# Altium schematic sheet Power Supply.SchDoc (part 5 of 5)
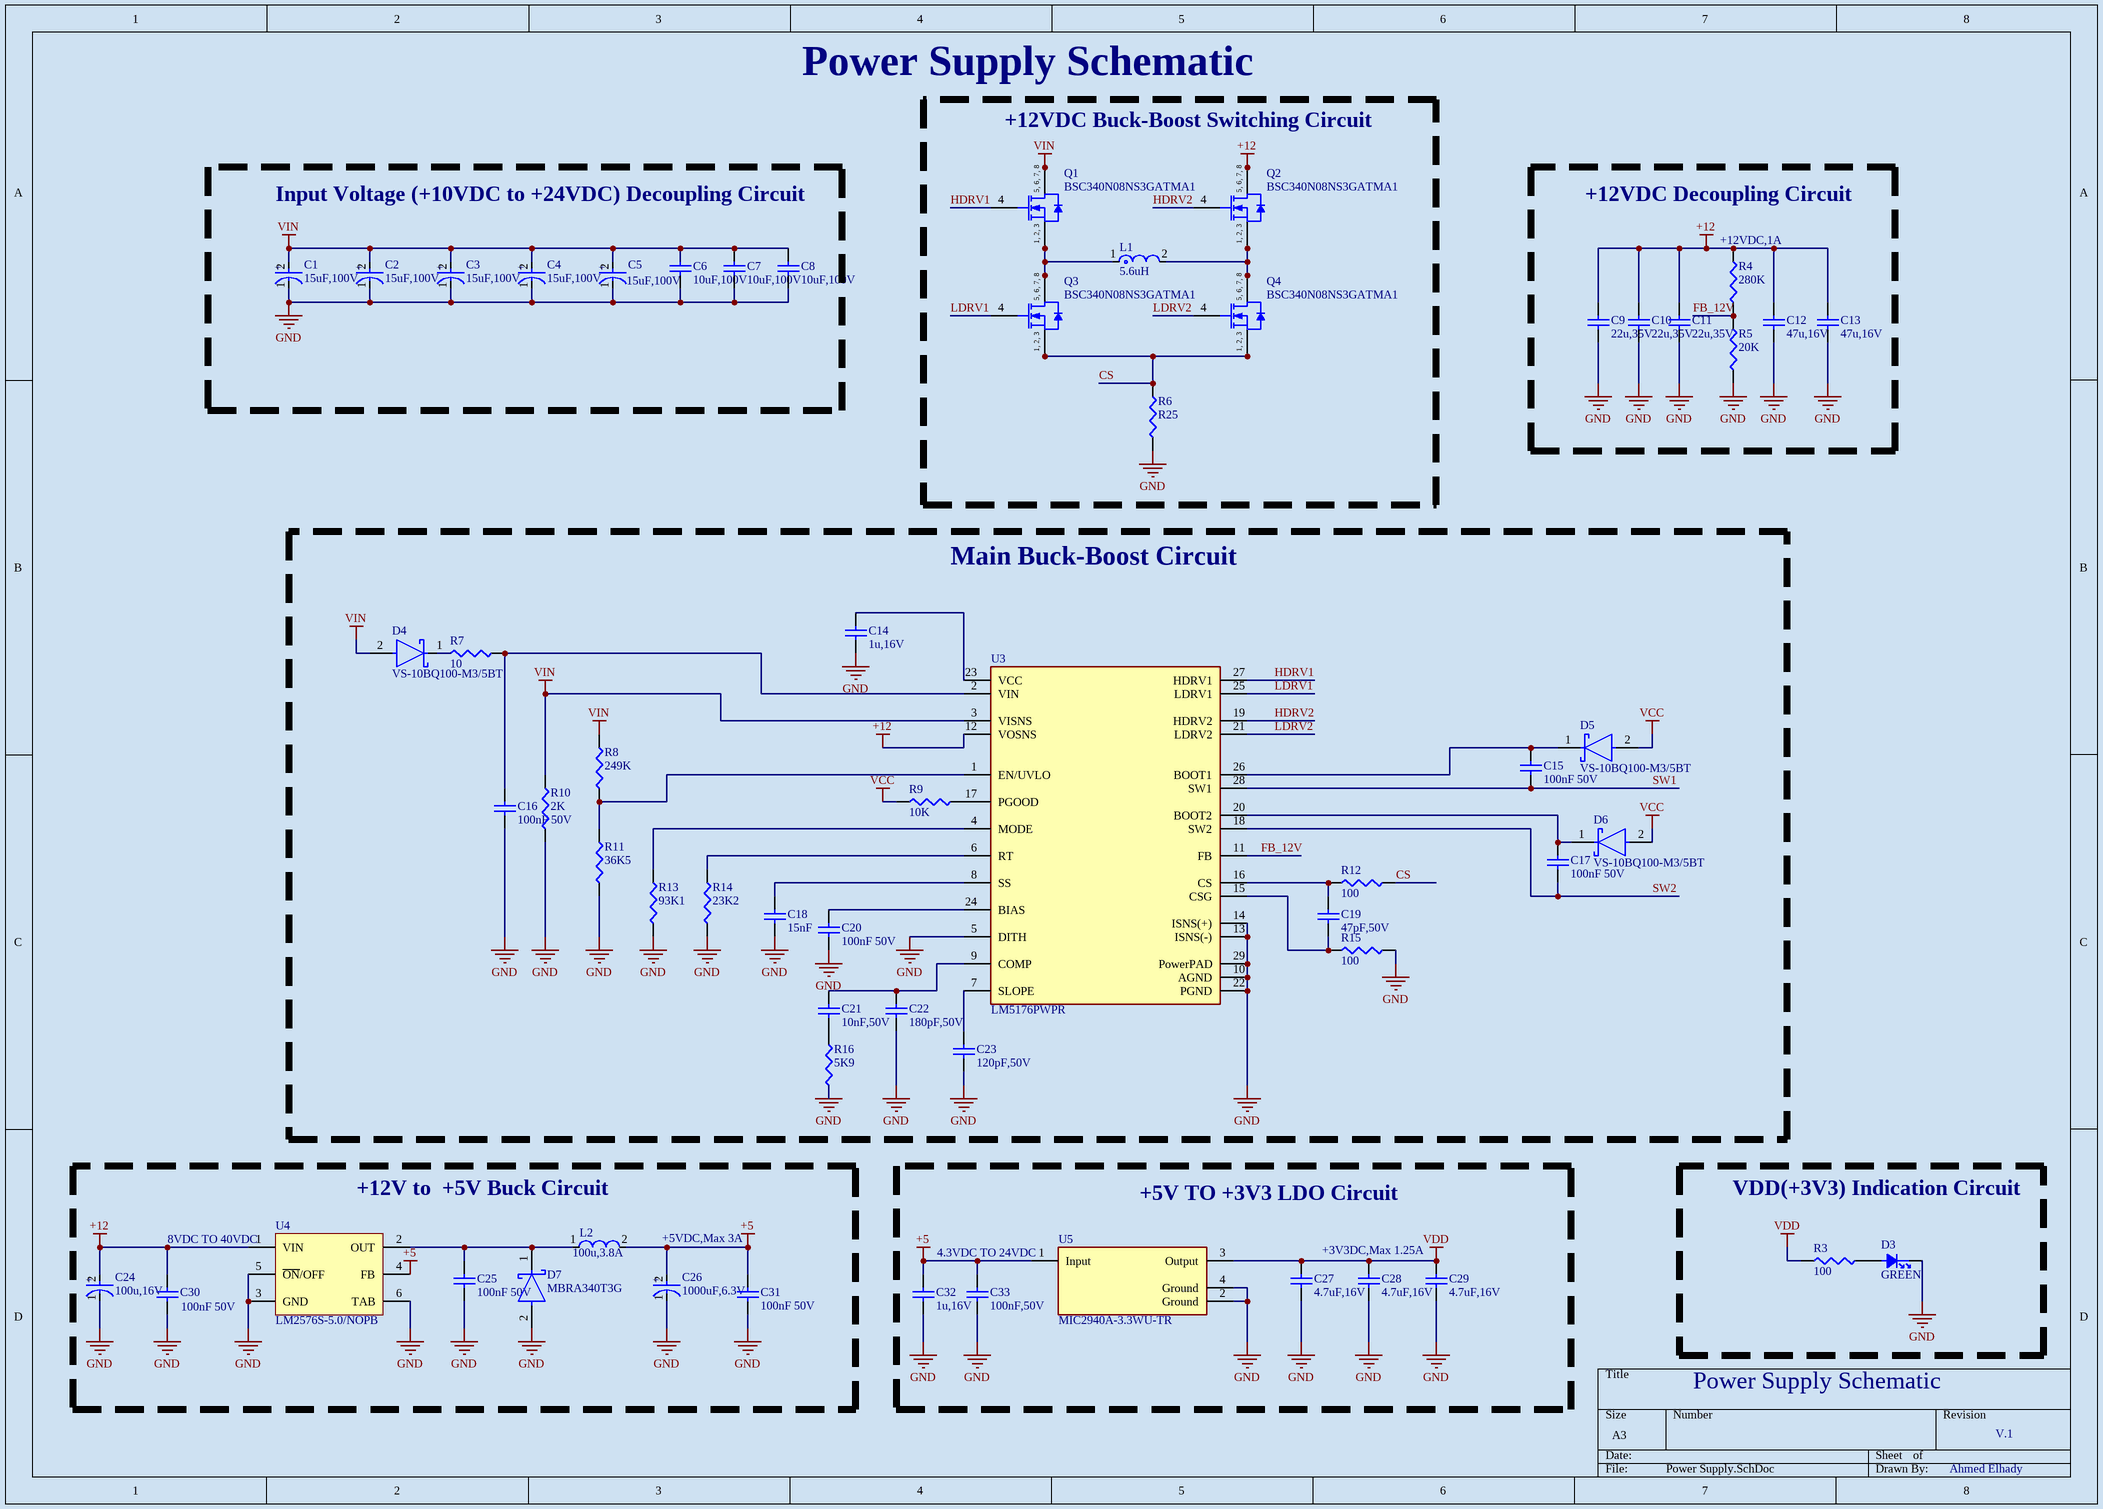
[diagram p4: Power Supply.SchDoc]

## Library data of the parts (continued)
R14 = CRCW040223K2FKED: 23.2 kOhms ±1% 0.063W, 1/16W Chip Resistor 0402 (1005 Metric) Automotive AEC-Q200 Thick Film; Manufacturer: Vishay; Max Power Dissipation: 63mW; Value: 23.2kΩ; Temperature Coefficient: 100ppm/°C; Voltage Rating: 50V; Supplier: DigiKey; Manufacturer Part Number: CRCW040223K2FKED; RoHS: Compliant; Category: Chip SMD Resistors; Stock: 48935; Pricing: 1=0.1, 10=0.03, 25=0.0224, 50=0.018, 100=0.0148, 250=0.01156, 500=0.00974, 1000=0.00832, 5000=0.00637, 10000=0.00438, 20000=0.00433, 30000=0.0043, 50000=0.00427, 70000=0.00425, 100000=0.00414, 120000=0.00407, 240000=0.00384, 250000=0.00383 (USD); Case/Package: 0402; Case Code (Imperial): 0402; China RoHS: Non-Compliant; Composition: Thick Film; Contact Plating: Tin; Depth: 500µm; Features: Automotive AEC-Q200; Height: 350µm; Lead Free: Lead Free; Length: 1mm; Lifecycle Status: Production; Max Operating Temperature: 155°C; Military Standard: Not; Min Operating Temperature: -55°C; Mounting Technology: Surface Mount; Pins: 2; Number of Terminals: 2; Number of Terminations: 2; Packaging: Cut Tape; Power Dissipation: 63mW; Power Rating: 63mW; Radiation Hardening: No; REACH SVHC: Yes; Schedule B: 8533210045; Termination: SMD/SMT; Tolerance: 1%; Voltage Rating (DC): 50V; Weight: 652.039032µg; Width: 500µm; Working Voltage: 50V; ComponentLink1URL: https://datasheet.octopart.com:443/CRCW040223K2FKED-Vishay-datasheet-175423584.pdf?src-supplier=IHS; ComponentLink1Description: https://datasheet.octopart.com:443/CRCW040223K2FKED-Vishay-datasheet-175423584.pdf?src-supplier=IHS; ComponentLink2URL: https://datasheet.octopart.com:443/CRCW040223K2FKED-Vishay-datasheet-190005712.pdf?src-supplier=TME; ComponentLink2Description: https://datasheet.octopart.com:443/CRCW040223K2FKED-Vishay-datasheet-190005712.pdf?src-supplier=TME; ComponentLink3URL: https://datasheet.octopart.com:443/CRCW040223K2FKED.-Vishay-datasheet-83961561.pdf?src-supplier=element14+APAC; ComponentLink3Description: https://datasheet.octopart.com:443/CRCW040223K2FKED.-Vishay-datasheet-83961561.pdf?src-supplier=element14+APAC; ComponentLink4URL: https://datasheet.octopart.com:443/CRCW040223K2FKED-Vishay-datasheet-66077789.pdf?src-supplier=element14+APAC; ComponentLink4Description: https://datasheet.octopart.com:443/CRCW040223K2FKED-Vishay-datasheet-66077789.pdf?src-supplier=element14+APAC; ComponentLink5URL: https://datasheet.octopart.com:443/CRCW040223K2FKED-Vishay-datasheet-62317933.pdf?src-supplier=element14+APAC; ComponentLink5Description: https://datasheet.octopart.com:443/CRCW040223K2FKED-Vishay-datasheet-62317933.pdf?src-supplier=element14+APAC; ComponentLink6URL: https://datasheet.octopart.com:443/CRCW040223K2FKED-Vishay-datasheet-14722531.pdf?src-supplier=element14+APAC; ComponentLink6Description: https://datasheet.octopart.com:443/CRCW040223K2FKED-Vishay-datasheet-14722531.pdf?src-supplier=element14+APAC; ComponentLink7URL: https://datasheet.octopart.com:443/CRCW040223K2FKED.-Vishay-datasheet-78776209.pdf?src-supplier=Newark; ComponentLink7Description: https://datasheet.octopart.com:443/CRCW040223K2FKED.-Vishay-datasheet-78776209.pdf?src-supplier=Newark; ComponentLink8URL: https://datasheet.octopart.com:443/CRCW040223K2FKED-Vishay-datasheet-11761042.pdf?src-supplier=Newark; ComponentLink8Description: https://datasheet.octopart.com:443/CRCW040223K2FKED-Vishay-datasheet-11761042.pdf?src-supplier=Newark; ComponentLink9URL: https://datasheet.octopart.com:443/CRCW040223K2FKED-Vishay-datasheet-159614168.pdf?src-supplier=Newark; ComponentLink9Description: https://datasheet.octopart.com:443/CRCW040223K2FKED-Vishay-datasheet-159614168.pdf?src-supplier=Newark; ComponentLink10URL: https://datasheet.octopart.com:443/CRCW040223K2FKED-Vishay-datasheet-33013972.pdf?src-supplier=Newark; ComponentLink10Description: https://datasheet.octopart.com:443/CRCW040223K2FKED-Vishay-datasheet-33013972.pdf?src-supplier=Newark; ComponentLink11URL: https://datasheet.octopart.com:443/CRCW040223K2FKED-Vishay-datasheet-21268114.pdf?src-supplier=Newark; ComponentLink11Description: https://datasheet.octopart.com:443/CRCW040223K2FKED-Vishay-datasheet-21268114.pdf?src-supplier=Newark; ComponentLink12URL: https://datasheet.octopart.com:443/CRCW040223K2FKED-Vishay-datasheet-21226360.pdf?src-supplier=Newark; ComponentLink12Description: https://datasheet.octopart.com:443/CRCW040223K2FKED-Vishay-datasheet-21226360.pdf?src-supplier=Newark; ComponentLink13URL: https://datasheet.octopart.com:443/CRCW040223K2FKED-Vishay-datasheet-62316122.pdf?src-supplier=Future+Electronics; ComponentLink13Description: https://datasheet.octopart.com:443/CRCW040223K2FKED-Vishay-datasheet-62316122.pdf?src-supplier=Future+Electronics; ComponentLink14URL: https://datasheet.octopart.com:443/CRCW040223K2FKED-Vishay-datasheet-12509741.pdf?src-supplier=Future+Electronics; ComponentLink14Description: https://datasheet.octopart.com:443/CRCW040223K2FKED-Vishay-datasheet-12509741.pdf?src-supplier=Future+Electronics; ComponentLink15URL: https://datasheet.octopart.com:443/CRCW040223K2FKED-Vishay-Dale-datasheet-47688880.pdf?src-supplier=RS+(Formerly+Allied+Electronics); ComponentLink15Description: https://datasheet.octopart.com:443/CRCW040223K2FKED-Vishay-Dale-datasheet-47688880.pdf?src-supplier=RS+(Formerly+Allied+Electronics); ComponentLink16URL: https://datasheet.octopart.com:443/CRCW040223K2FKED-Vishay-datasheet-12001583.pdf?src-supplier=RS+(Formerly+Allied+Electronics); ComponentLink16Description: https://datasheet.octopart.com:443/CRCW040223K2FKED-Vishay-datasheet-12001583.pdf?src-supplier=RS+(Formerly+Allied+Electronics); ComponentLink17URL: https://datasheet.octopart.com:443/CRCW040223K2FKED-Vishay-datasheet-5306405.pdf?src-supplier=RS+(Formerly+Allied+Electronics); ComponentLink17Description: https://datasheet.octopart.com:443/CRCW040223K2FKED-Vishay-datasheet-5306405.pdf?src-supplier=RS+(Formerly+Allied+Electronics); ComponentLink18URL: https://datasheet.octopart.com/D-CRCW-e3-Standard-Thick-Film-Chip-Resistors-Vishay-datasheet-family-64.pdf; ComponentLink18Description: https://datasheet.octopart.com/D-CRCW-e3-Standard-Thick-Film-Chip-Resistors-Vishay-datasheet-family-64.pdf; ComponentLink19URL: https://datasheet.octopart.com:443/CRCW040223K2FKED-Vishay-datasheet-11516975.pdf?src-supplier=Farnell; ComponentLink19Description: https://datasheet.octopart.com:443/CRCW040223K2FKED-Vishay-datasheet-11516975.pdf?src-supplier=Farnell; ComponentLink20URL: https://datasheet.octopart.com:443/CRCW040223K2FKED-Vishay-datasheet-512477.pdf?src-supplier=Farnell; ComponentLink20Description: https://datasheet.octopart.com:443/CRCW040223K2FKED-Vishay-datasheet-512477.pdf?src-supplier=Farnell; ComponentLink21URL: https://datasheet.octopart.com:443/CRCW040223K2FKED-Vishay-datasheet-11540273.pdf?src-supplier=Arrow+Electronics; ComponentLink21Description: https://datasheet.octopart.com:443/CRCW040223K2FKED-Vishay-datasheet-11540273.pdf?src-supplier=Arrow+Electronics; ComponentLink22URL: https://datasheet.octopart.com:443/CRCW040223K2FKED-Vishay-datasheet-8445837.pdf?src-supplier=element14; ComponentLink22Description: https://datasheet.octopart.com:443/CRCW040223K2FKED-Vishay-datasheet-8445837.pdf?src-supplier=element14; ComponentLink23URL: https://datasheet.octopart.com:443/CRCW040223K2FKED-Vishay-datasheet-5377255.pdf?src-supplier=Garrett; ComponentLink23Description: https://datasheet.octopart.com:443/CRCW040223K2FKED-Vishay-datasheet-5377255.pdf?src-supplier=Garrett; ComponentLink24URL: https://datasheet.octopart.com:443/CRCW040223K2FKED-Vishay-datasheet-148188.pdf?src-supplier=Garrett; ComponentLink24Description: https://datasheet.octopart.com:443/CRCW040223K2FKED-Vishay-datasheet-148188.pdf?src-supplier=Garrett; ComponentLink25URL: https://datasheet.octopart.com:443/CRCW040223K2FKED-Vishay-datasheet-42367.pdf?src-supplier=Garrett; ComponentLink25Description: https://datasheet.octopart.com:443/CRCW040223K2FKED-Vishay-datasheet-42367.pdf?src-supplier=Garrett; ComponentLink26URL: http://sigma.octopart.com:80/rohs_certificate/D-CRCW-e3-Standard-Thick-Film-Chip-Resistors-Vishay-family-102.pdf?src-supplier=Compliance+Statements; ComponentLink26Description: http://sigma.octopart.com:80/rohs_certificate/D-CRCW-e3-Standard-Thick-Film-Chip-Resistors-Vishay-family-102.pdf?src-supplier=Compliance+Statements; LCSC PN: C2076557
R16 = CRCW04025K90FKED: 5.9 kOhms ±1% 0.063W, 1/16W Chip Resistor 0402 (1005 Metric) Automotive AEC-Q200 Thick Film; Manufacturer: Vishay; Max Power Dissipation: 63mW; Value: 5.9kΩ; Temperature Coefficient: 100ppm/°C; Voltage Rating: 50V; Supplier: DigiKey; Manufacturer Part Number: CRCW04025K90FKED; RoHS: Compliant; Category: Chip SMD Resistors; Stock: 139555; Pricing: 1=0.1, 10=0.03, 25=0.0224, 50=0.018, 100=0.0148, 250=0.01156, 500=0.00974, 1000=0.00832, 5000=0.00637 (USD); Case/Package: 0402; Case Code (Imperial): 0402; China RoHS: Non-Compliant; Composition: Thick Film; Contact Plating: Tin; Depth: 500µm; Features: Automotive AEC-Q200; Height: 350µm; Lead Free: Lead Free; Length: 1mm; Lifecycle Status: Production; Max Operating Temperature: 155°C; Military Standard: Not; Min Operating Temperature: -55°C; Mounting Technology: Surface Mount; Pins: 2; Number of Terminals: 2; Number of Terminations: 2; Packaging: Cut Tape; Power Dissipation: 63mW; Power Rating: 63mW; Radiation Hardening: No; REACH SVHC: Yes; Schedule B: 8533210045; Termination: SMD/SMT; Tolerance: 1%; Voltage Rating (DC): 50V; Weight: 652.039032µg; Width: 500µm; Working Voltage: 50V; ComponentLink1URL: https://datasheet.octopart.com:443/CRCW04025K90FKED-Vishay-datasheet-175423584.pdf?src-supplier=IHS; ComponentLink1Description: https://datasheet.octopart.com:443/CRCW04025K90FKED-Vishay-datasheet-175423584.pdf?src-supplier=IHS; ComponentLink2URL: https://datasheet.octopart.com:443/CRCW04025K90FKED-Vishay-datasheet-190005712.pdf?src-supplier=TME; ComponentLink2Description: https://datasheet.octopart.com:443/CRCW04025K90FKED-Vishay-datasheet-190005712.pdf?src-supplier=TME; ComponentLink3URL: https://datasheet.octopart.com:443/CRCW04025K90FKED-Vishay-datasheet-66077789.pdf?src-supplier=Newark; ComponentLink3Description: https://datasheet.octopart.com:443/CRCW04025K90FKED-Vishay-datasheet-66077789.pdf?src-supplier=Newark; ComponentLink4URL: https://datasheet.octopart.com:443/CRCW04025K90FKED-Vishay-datasheet-11761042.pdf?src-supplier=Newark; ComponentLink4Description: https://datasheet.octopart.com:443/CRCW04025K90FKED-Vishay-datasheet-11761042.pdf?src-supplier=Newark; ComponentLink5URL: https://datasheet.octopart.com:443/CRCW04025K90FKED-Vishay-datasheet-41302739.pdf?src-supplier=Newark; ComponentLink5Description: https://datasheet.octopart.com:443/CRCW04025K90FKED-Vishay-datasheet-41302739.pdf?src-supplier=Newark; ComponentLink6URL: https://datasheet.octopart.com:443/CRCW04025K90FKED-Vishay-datasheet-33013972.pdf?src-supplier=Newark; ComponentLink6Description: https://datasheet.octopart.com:443/CRCW04025K90FKED-Vishay-datasheet-33013972.pdf?src-supplier=Newark; ComponentLink7URL: https://datasheet.octopart.com:443/CRCW04025K90FKED-Vishay-datasheet-21226360.pdf?src-supplier=Newark; ComponentLink7Description: https://datasheet.octopart.com:443/CRCW04025K90FKED-Vishay-datasheet-21226360.pdf?src-supplier=Newark; ComponentLink8URL: https://datasheet.octopart.com:443/CRCW04025K90FKED-Vishay-datasheet-62317933.pdf?src-supplier=Farnell; ComponentLink8Description: https://datasheet.octopart.com:443/CRCW04025K90FKED-Vishay-datasheet-62317933.pdf?src-supplier=Farnell; ComponentLink9URL: https://datasheet.octopart.com:443/CRCW04025K90FKED.-Vishay-datasheet-83961561.pdf?src-supplier=Farnell; ComponentLink9Description: https://datasheet.octopart.com:443/CRCW04025K90FKED.-Vishay-datasheet-83961561.pdf?src-supplier=Farnell; ComponentLink10URL: https://datasheet.octopart.com:443/CRCW04025K90FKED-Vishay-datasheet-11516975.pdf?src-supplier=Farnell; ComponentLink10Description: https://datasheet.octopart.com:443/CRCW04025K90FKED-Vishay-datasheet-11516975.pdf?src-supplier=Farnell; ComponentLink11URL: https://datasheet.octopart.com:443/CRCW04025K90FKED-Vishay-datasheet-14722531.pdf?src-supplier=element14+APAC; ComponentLink11Description: https://datasheet.octopart.com:443/CRCW04025K90FKED-Vishay-datasheet-14722531.pdf?src-supplier=element14+APAC; ComponentLink12URL: https://datasheet.octopart.com:443/CRCW04025K90FKED-Vishay-datasheet-5299586.pdf?src-supplier=element14+APAC; ComponentLink12Description: https://datasheet.octopart.com:443/CRCW04025K90FKED-Vishay-datasheet-5299586.pdf?src-supplier=element14+APAC; ComponentLink13URL: https://datasheet.octopart.com:443/CRCW04025K90FKED-Vishay-datasheet-10380026.pdf?src-supplier=element14+APAC; ComponentLink13Description: https://datasheet.octopart.com:443/CRCW04025K90FKED-Vishay-datasheet-10380026.pdf?src-supplier=element14+APAC; ComponentLink14URL: https://datasheet.octopart.com:443/CRCW04025K90FKED-Vishay-datasheet-62316122.pdf?src-supplier=Future+Electronics; ComponentLink14Description: https://datasheet.octopart.com:443/CRCW04025K90FKED-Vishay-datasheet-62316122.pdf?src-supplier=Future+Electronics; ComponentLink15URL: https://datasheet.octopart.com:443/CRCW04025K90FKED-Vishay-datasheet-12519820.pdf?src-supplier=Future+Electronics; ComponentLink15Description: https://datasheet.octopart.com:443/CRCW04025K90FKED-Vishay-datasheet-12519820.pdf?src-supplier=Future+Electronics; ComponentLink16URL: https://datasheet.octopart.com:443/CRCW04025K90FKED-Vishay-Dale-datasheet-47688880.pdf?src-supplier=RS+(Formerly+Allied+Electronics); ComponentLink16Description: https://datasheet.octopart.com:443/CRCW04025K90FKED-Vishay-Dale-datasheet-47688880.pdf?src-supplier=RS+(Formerly+Allied+Electronics); ComponentLink17URL: https://datasheet.octopart.com:443/CRCW04025K90FKED-Vishay-datasheet-12001583.pdf?src-supplier=RS+(Formerly+Allied+Electronics); ComponentLink17Description: https://datasheet.octopart.com:443/CRCW04025K90FKED-Vishay-datasheet-12001583.pdf?src-supplier=RS+(Formerly+Allied+Electronics); ComponentLink18URL: https://datasheet.octopart.com:443/CRCW04025K90FKED-Vishay-datasheet-5306405.pdf?src-supplier=RS+(Formerly+Allied+Electronics); ComponentLink18Description: https://datasheet.octopart.com:443/CRCW04025K90FKED-Vishay-datasheet-5306405.pdf?src-supplier=RS+(Formerly+Allied+Electronics); ComponentLink19URL: https://datasheet.octopart.com/D-CRCW-e3-Standard-Thick-Film-Chip-Resistors-Vishay-datasheet-family-64.pdf; ComponentLink19Description: https://datasheet.octopart.com/D-CRCW-e3-Standard-Thick-Film-Chip-Resistors-Vishay-datasheet-family-64.pdf; ComponentLink20URL: https://datasheet.octopart.com:443/CRCW04025K90FKED-Vishay-datasheet-8445837.pdf?src-supplier=element14; ComponentLink20Description: https://datasheet.octopart.com:443/CRCW04025K90FKED-Vishay-datasheet-8445837.pdf?src-supplier=element14; ComponentLink21URL: https://datasheet.octopart.com:443/CRCW04025K90FKED-Vishay-datasheet-5377255.pdf?src-supplier=Garrett; ComponentLink21Description: https://datasheet.octopart.com:443/CRCW04025K90FKED-Vishay-datasheet-5377255.pdf?src-supplier=Garrett; ComponentLink22URL: https://datasheet.octopart.com:443/CRCW04025K90FKED-Vishay-datasheet-148188.pdf?src-supplier=Garrett; ComponentLink22Description: https://datasheet.octopart.com:443/CRCW04025K90FKED-Vishay-datasheet-148188.pdf?src-supplier=Garrett; ComponentLink23URL: https://datasheet.octopart.com:443/CRCW04025K90FKED-Vishay-datasheet-42367.pdf?src-supplier=Garrett; ComponentLink23Description: https://datasheet.octopart.com:443/CRCW04025K90FKED-Vishay-datasheet-42367.pdf?src-supplier=Garrett; ComponentLink24URL: http://sigma.octopart.com:80/rohs_certificate/D-CRCW-e3-Standard-Thick-Film-Chip-Resistors-Vishay-family-102.pdf?src-supplier=Compliance+Statements; ComponentLink24Description: http://sigma.octopart.com:80/rohs_certificate/D-CRCW-e3-Standard-Thick-Film-Chip-Resistors-Vishay-family-102.pdf?src-supplier=Compliance+Statements; LCSC PN: C2085399
U3 = LM5176PWPR: Buck-Boost Regulator Positive Output Step-Up/Step-Down DC-DC Controller IC 28-HTSSOP; Manufacturer: Texas Instruments; Manufacturer Lifecycle Status: ACTIVE; Supplier: DigiKey; Manufacturer Part Number: LM5176PWPR; RoHS: Compliant; Category: Integrated Circuits (ICs); Stock: 2903; Pricing: 1=7.76, 10=6.004, 25=5.5644, 100=5.0815, 250=4.85124, 500=4.71244, 1000=4.59822 (USD); Height: 1.2mm; Length: 9.7mm; Lifecycle Status: Production; Max Operating Temperature: 125°C; Min Operating Temperature: -40°C; Pins: 28; Schedule B: 8542390000, 8542390000|8542390000|8542390000|8542390000|8542390000; Thickness: 1mm; Topology: Buck-Boost; Width: 4.4mm; ComponentLink1URL: https://sigma.octopart.com:443/149651771/technical_drawing/Texas-Instruments-LM5176PWPR.pdf?src-supplier=Texas+Instruments; ComponentLink1Description: https://sigma.octopart.com:443/149651771/technical_drawing/Texas-Instruments-LM5176PWPR.pdf?src-supplier=Texas+Instruments; ComponentLink2URL: https://octopart.com:443/opatz8j6/c1?t=vc9joNWpwikMECXl6jF3E6Rz0PZzyxJ3n3avslgP6iGH_Pm5K3HR4EsbWHcWcqIwfDGu90-AGlzUONDyCsw9SQjo38uZJTNl_w7gbkiBgEYgQyjwYYxXEhyIccZGENrah1CXUA36_ziZ7gkexytO-K5vyI9DK7METPvHxjBHvmNi7OG2pls60FX5nxWavgVQIbahnLozQoMaI7COdlCCGP_rK5NhxD3Zcy536ewMOB-0ew3sExV3JOwhmLFHLLPgOPFcGktcdZRW_oquGXAgjDjlXW9igv-y-SbO22o8f6JpQ7Y9bUyjZdLcKuJKpBPJ_JZEwxLu5Gu4m0ryBmHhYRwT4KNP0P55HakqvFZvEL0VRet7s9h1vAUAT8aDmYu6rw4H&src-supplier=Texas+Instruments; ComponentLink2Description: https://octopart.com:443/opatz8j6/c1?t=vc9joNWpwikMECXl6jF3E6Rz0PZzyxJ3n3avslgP6iGH_Pm5K3HR4EsbWHcWcqIwfDGu90-AGlzUONDyCsw9SQjo38uZJTNl_w7gbkiBgEYgQyjwYYxXEhyIccZGENrah1CXUA36_ziZ7gkexytO-K5vyI9DK7METPvHxjBHvmNi7OG2pls60FX5nxWavgVQIbahnLozQoMaI7COdlCCGP_rK5NhxD3Zcy536ewMOB-0ew3sExV3JOwhmLFHLLPgOPFcGktcdZRW_oquGXAgjDjlXW9igv-y-SbO22o8f6JpQ7Y9bUyjZdLcKuJKpBPJ_JZEwxLu5Gu4m0ryBmHhYRwT4KNP0P55HakqvFZvEL0VRet7s9h1vAUAT8aDmYu6rw4H&src-supplier=Texas+Instruments; ComponentLink3URL: https://sigma.octopart.com:443/49250896/technical_drawing/Texas-Instruments-LM5176PWPR.pdf?src-supplier=Texas+Instruments; ComponentLink3Description: https://sigma.octopart.com:443/49250896/technical_drawing/Texas-Instruments-LM5176PWPR.pdf?src-supplier=Texas+Instruments; ComponentLink4URL: http://sigma.octopart.com:80/conflict_mineral_statement/Texas-Instruments-company-63.pdf?src-supplier=Compliance+Statements; ComponentLink4Description: http://sigma.octopart.com:80/conflict_mineral_statement/Texas-Instruments-company-63.pdf?src-supplier=Compliance+Statements; ComponentLink5URL: http://sigma.octopart.com:80/reach_statement/Texas-Instruments-company-64.pdf?src-supplier=Compliance+Statements; ComponentLink5Description: http://sigma.octopart.com:80/reach_statement/Texas-Instruments-company-64.pdf?src-supplier=Compliance+Statements; LCSC PN: C442493
U4 = LM2576S-5.0/NOPB: Buck Switching Regulator IC Positive Fixed 5V 1 Output 3A TO-263-6, D2PAK (5 Leads + Tab), TO-263BA; Manufacturer: Texas Instruments; Manufacturer Lifecycle Status: ACTIVE; Efficiency: 77%; Frequency: 52kHz; Max Supply Voltage: 40V; Min Input Voltage: 4V; Number of Channels: 1; Quiescent Current: 5mA; Switching Frequency: 58kHz; Supplier: DigiKey; Manufacturer Part Number: LM2576S-5.0/NOPB; RoHS: Compliant; Category: Voltage Regulators - Switching; Stock: 2580; Pricing: 1=4.48, 10=3.404, 45=2.99378, 135=2.78644, 270=2.68493, 540=2.60139, 1035=2.53646, 2520=2.46488 (USD); Case/Package: TO-263; Contact Plating: Tin; Height: 4.83mm; Length: 10.16mm; Lifecycle Status: Production; Max Operating Temperature: 125°C; Max Output current: 3A; Max Output Voltage: 5V; Min Operating Temperature: -40°C; Min Supply Voltage: 4V; Mounting Technology: Surface Mount; Nominal Output Voltage: 5V; Number of Outputs: 1; Pins: 5; Output Current: 3A; Output Type: Fixed; Output Voltage: 5V; Radiation Hardening: No; REACH SVHC: No; Schedule B: 8542390000, 8542390000|8542390000, 8542390000|8542390000|8542390000, 8542390000|8542390000|8542390000|8542390000; Termination: SMD/SMT; Thickness: 4.58mm; Topology: Buck; Weight: 113.398093g; Width: 8.42mm; ComponentLink1URL: https://datasheet.octopart.com:443/LM2576S-5.0-NOPB-Texas-Instruments-datasheet-31978431.pdf?src-supplier=Texas+Instruments; ComponentLink1Description: https://datasheet.octopart.com:443/LM2576S-5.0-NOPB-Texas-Instruments-datasheet-31978431.pdf?src-supplier=Texas+Instruments; ComponentLink2URL: https://octopart.com:443/opatz8j6/c1?t=vTLdpRcAlzxwQmwqkV-g5MTzL91FKiO8YCI-dhDlBjpFOXpoGPAkGRLiTPFv47FK8lYGfcXnum07RhFvMeg1HOGeo0LtdumxMxlN-xIkQw_vfXVzXGM0akenp6bKSTQFj1ZNusz68omFsyoOEm7g8d48LyM-SBkJ450NokXq2LiP3OuQAUCWRcJ0fwOEKd-FiuQnLDD6_BmQm3RvgjH20xeAZz2rgyw7lq3YoxOYrDy4xa6ZrBdDRdlCT8mEW5r_sEj2UZ1aF5CWxKLh0_vzSqei1yh5VZFFU7dwVtAbvRRfzdO2kJX0aQP-zxD6PSGdgU1GpBbMbKmIB9_ozpNjtvVts8IHig-UoyxZFed4aLsETwF_D_Fqylvb_4qKpcoF7BDWuA&src-supplier=Texas+Instruments; ComponentLink2Description: https://octopart.com:443/opatz8j6/c1?t=vTLdpRcAlzxwQmwqkV-g5MTzL91FKiO8YCI-dhDlBjpFOXpoGPAkGRLiTPFv47FK8lYGfcXnum07RhFvMeg1HOGeo0LtdumxMxlN-xIkQw_vfXVzXGM0akenp6bKSTQFj1ZNusz68omFsyoOEm7g8d48LyM-SBkJ450NokXq2LiP3OuQAUCWRcJ0fwOEKd-FiuQnLDD6_BmQm3RvgjH20xeAZz2rgyw7lq3YoxOYrDy4xa6ZrBdDRdlCT8mEW5r_sEj2UZ1aF5CWxKLh0_vzSqei1yh5VZFFU7dwVtAbvRRfzdO2kJX0aQP-zxD6PSGdgU1GpBbMbKmIB9_ozpNjtvVts8IHig-UoyxZFed4aLsETwF_D_Fqylvb_4qKpcoF7BDWuA&src-supplier=Texas+Instruments; ComponentLink3URL: https://sigma.octopart.com:443/49250911/technical_drawing/Texas-Instruments-LM2576S-5.0-NOPB.pdf?src-supplier=Texas+Instruments; ComponentLink3Description: https://sigma.octopart.com:443/49250911/technical_drawing/Texas-Instruments-LM2576S-5.0-NOPB.pdf?src-supplier=Texas+Instruments; ComponentLink4URL: https://datasheet.octopart.com:443/LM2576S-5.0-NOPB-Texas-Instruments-datasheet-14775416.pdf?src-supplier=Texas+Instruments; ComponentLink4Description: https://datasheet.octopart.com:443/LM2576S-5.0-NOPB-Texas-Instruments-datasheet-14775416.pdf?src-supplier=Texas+Instruments; ComponentLink5URL: https://datasheet.octopart.com:443/LM2576S-5.0/NOPB-Texas-Instruments-datasheet-13482831.pdf?src-supplier=Texas+Instruments; ComponentLink5Description: https://datasheet.octopart.com:443/LM2576S-5.0/NOPB-Texas-Instruments-datasheet-13482831.pdf?src-supplier=Texas+Instruments; ComponentLink6URL: https://datasheet.octopart.com:443/LM2576S-5.0/NOPB-Texas-Instruments-datasheet-10618141.pdf?src-supplier=element14; ComponentLink6Description: https://datasheet.octopart.com:443/LM2576S-5.0/NOPB-Texas-Instruments-datasheet-10618141.pdf?src-supplier=element14; ComponentLink7URL: https://datasheet.octopart.com:443/LM2576S-5.0-NOPB-Texas-Instruments-datasheet-2713.pdf?src-supplier=element14; ComponentLink7Description: https://datasheet.octopart.com:443/LM2576S-5.0-NOPB-Texas-Instruments-datasheet-2713.pdf?src-supplier=element14; ComponentLink8URL: https://datasheet.octopart.com:443/LM2576S-5.0-NOPB-Texas-Instruments-datasheet-21076658.pdf?src-supplier=Newark; ComponentLink8Description: https://datasheet.octopart.com:443/LM2576S-5.0-NOPB-Texas-Instruments-datasheet-21076658.pdf?src-supplier=Newark; ComponentLink9URL: https://datasheet.octopart.com:443/LM2576S-5.0-NOPB-Texas-Instruments-datasheet-58101102.pdf?src-supplier=Newark; ComponentLink9Description: https://datasheet.octopart.com:443/LM2576S-5.0-NOPB-Texas-Instruments-datasheet-58101102.pdf?src-supplier=Newark; ComponentLink10URL: https://datasheet.octopart.com:443/LM2576S-5.0-NOPB-Texas-Instruments-datasheet-21076659.pdf?src-supplier=Farnell; ComponentLink10Description: https://datasheet.octopart.com:443/LM2576S-5.0-NOPB-Texas-Instruments-datasheet-21076659.pdf?src-supplier=Farnell; ComponentLink11URL: https://datasheet.octopart.com:443/LM2576S-5.0-NOPB-Texas-Instruments-datasheet-14720404.pdf?src-supplier=Farnell; ComponentLink11Description: https://datasheet.octopart.com:443/LM2576S-5.0-NOPB-Texas-Instruments-datasheet-14720404.pdf?src-supplier=Farnell; ComponentLink12URL: https://datasheet.octopart.com:443/LM2576S-5.0-NOPB-Texas-Instruments-datasheet-164397537.pdf?src-supplier=LCSC; ComponentLink12Description: https://datasheet.octopart.com:443/LM2576S-5.0-NOPB-Texas-Instruments-datasheet-164397537.pdf?src-supplier=LCSC; ComponentLink13URL: https://datasheet.octopart.com:443/LM2576S-5.0-NOPB-Texas-Instruments-datasheet-159115115.pdf?src-supplier=LCSC; ComponentLink13Description: https://datasheet.octopart.com:443/LM2576S-5.0-NOPB-Texas-Instruments-datasheet-159115115.pdf?src-supplier=LCSC; ComponentLink14URL: https://datasheet.octopart.com:443/LM2576S-5.0-NOPB-Texas-Instruments-datasheet-96976008.pdf?src-supplier=TME; ComponentLink14Description: https://datasheet.octopart.com:443/LM2576S-5.0-NOPB-Texas-Instruments-datasheet-96976008.pdf?src-supplier=TME; ComponentLink15URL: https://datasheet.octopart.com:443/LM2576S-5.0-NOPB-Texas-Instruments-datasheet-49271545.pdf?src-supplier=element14+APAC; ComponentLink15Description: https://datasheet.octopart.com:443/LM2576S-5.0-NOPB-Texas-Instruments-datasheet-49271545.pdf?src-supplier=element14+APAC; ComponentLink16URL: https://datasheet.octopart.com:443/LM2576S-5.0/NOPB-National-Semiconductor-datasheet-9902084.pdf?src-supplier=RS+(Formerly+Allied+Electronics); ComponentLink16Description: https://datasheet.octopart.com:443/LM2576S-5.0/NOPB-National-Semiconductor-datasheet-9902084.pdf?src-supplier=RS+(Formerly+Allied+Electronics); ComponentLink17URL: https://datasheet.octopart.com:443/LM2576S-5.0-NOPB-Texas-Instruments-datasheet-8321813.pdf?src-supplier=Jameco; ComponentLink17Description: https://datasheet.octopart.com:443/LM2576S-5.0-NOPB-Texas-Instruments-datasheet-8321813.pdf?src-supplier=Jameco; ComponentLink18URL: http://sigma.octopart.com:80/conflict_mineral_statement/Texas-Instruments-company-63.pdf?src-supplier=Compliance+Statements; ComponentLink18Description: http://sigma.octopart.com:80/conflict_mineral_statement/Texas-Instruments-company-63.pdf?src-supplier=Compliance+Statements; ComponentLink19URL: http://sigma.octopart.com:80/reach_statement/Texas-Instruments-company-64.pdf?src-supplier=Compliance+Statements; ComponentLink19Description: http://sigma.octopart.com:80/reach_statement/Texas-Instruments-company-64.pdf?src-supplier=Compliance+Statements; LCSC PN: C880552
U5 = MIC2940A-3.3WU-TR: Linear Voltage Regulator IC Positive Fixed 1 Output 1.25A TO-263-3; Manufacturer: Microchip; Accuracy: 2.5%; Dropout Voltage: 400mV; Max Supply Voltage: 26V; Max Junction Temperature (Tj): 125°C; Min Input Voltage: 2V; Min Output Voltage: 3.3V; Min Supply Voltage: 3.7V; Number of Outputs: 1; Output Voltage Accuracy: 1%; Quiescent Current: 500µA; Supplier: DigiKey; Manufacturer Part Number: MIC2940A-3.3WU-TR; RoHS: Compliant; Category: LDO Voltage Regulators; Stock: 772; Pricing: 1=2.67, 25=2.23, 100=2.03, 750=2.03001 (USD); Projected EOL Date: 2034-05-14; Case/Package: TO-263-3; Country of Assembly: China; Country of Fabrication: United States of America; Country of Origin: China; Export Control Classification Number (ECCN) Code: EAR99; Height: 4.902mm; Harmonized Tariff Schedule (HTS) Code: 8542.39.0060; Lead Free: Lead Free; Lifecycle Status: Production; Max Operating Temperature: 125°C; Max Output current: 1.25A; Min Operating Temperature: -40°C; Mounting Technology: Surface Mount; Pins: 3; Number of Regulators: 1; Output Current: 1.25A; Output Voltage: 3.3V; Polarity: Positive; Radiation Hardening: No; Schedule B: 8542390000; ComponentLink1URL: https://datasheet.octopart.com:443/MIC2940A-3.3WU-TR-Microchip-datasheet-164493852.pdf?src-supplier=Upverter; ComponentLink1Description: https://datasheet.octopart.com:443/MIC2940A-3.3WU-TR-Microchip-datasheet-164493852.pdf?src-supplier=Upverter; ComponentLink2URL: https://datasheet.octopart.com:443/MIC2940A-3.3WU-TR-Microchip-datasheet-109479.pdf?src-supplier=SHENGYU+ELECTRONICS; ComponentLink2Description: https://datasheet.octopart.com:443/MIC2940A-3.3WU-TR-Microchip-datasheet-109479.pdf?src-supplier=SHENGYU+ELECTRONICS; ComponentLink3URL: https://datasheet.octopart.com:443/MIC2940A-3.3WU-TR-Microchip-datasheet-134530682.pdf?src-supplier=Geoflip; ComponentLink3Description: https://datasheet.octopart.com:443/MIC2940A-3.3WU-TR-Microchip-datasheet-134530682.pdf?src-supplier=Geoflip; ComponentLink4URL: https://datasheet.octopart.com:443/MIC2940A-3.3WUTR-Micrel-datasheet-14170148.pdf?src-supplier=iiiC; ComponentLink4Description: https://datasheet.octopart.com:443/MIC2940A-3.3WUTR-Micrel-datasheet-14170148.pdf?src-supplier=iiiC; ComponentLink5URL: http://sigma.octopart.com:80/188455473/materials_sheet/Microchip-MIC2940A-3.3WU-TR.pdf?src-supplier=Compliance+Statements; ComponentLink5Description: http://sigma.octopart.com:80/188455473/materials_sheet/Microchip-MIC2940A-3.3WU-TR.pdf?src-supplier=Compliance+Statements; ComponentLink6URL: http://sigma.octopart.com:80/conflict_mineral_statement/Microchip-company-68.pdf?src-supplier=Compliance+Statements; ComponentLink6Description: http://sigma.octopart.com:80/conflict_mineral_statement/Microchip-company-68.pdf?src-supplier=Compliance+Statements; ComponentLink7URL: http://sigma.octopart.com:80/conflict_mineral_statement/Microchip-company-69.pdf?src-supplier=Compliance+Statements; ComponentLink7Description: http://sigma.octopart.com:80/conflict_mineral_statement/Microchip-company-69.pdf?src-supplier=Compliance+Statements; ComponentLink8URL: http://sigma.octopart.com:80/reach_statement/Microchip-company-70.pdf?src-supplier=Compliance+Statements; ComponentLink8Description: http://sigma.octopart.com:80/reach_statement/Microchip-company-70.pdf?src-supplier=Compliance+Statements; ComponentLink9URL: http://sigma.octopart.com:80/rohs_statement/Microchip-company-71.pdf?src-supplier=Compliance+Statements; ComponentLink9Description: http://sigma.octopart.com:80/rohs_statement/Microchip-company-71.pdf?src-supplier=Compliance+Statements; LCSC PN: C632743